# Altium project JacdacBreadboardEc30-16x6 128.PrjPCB
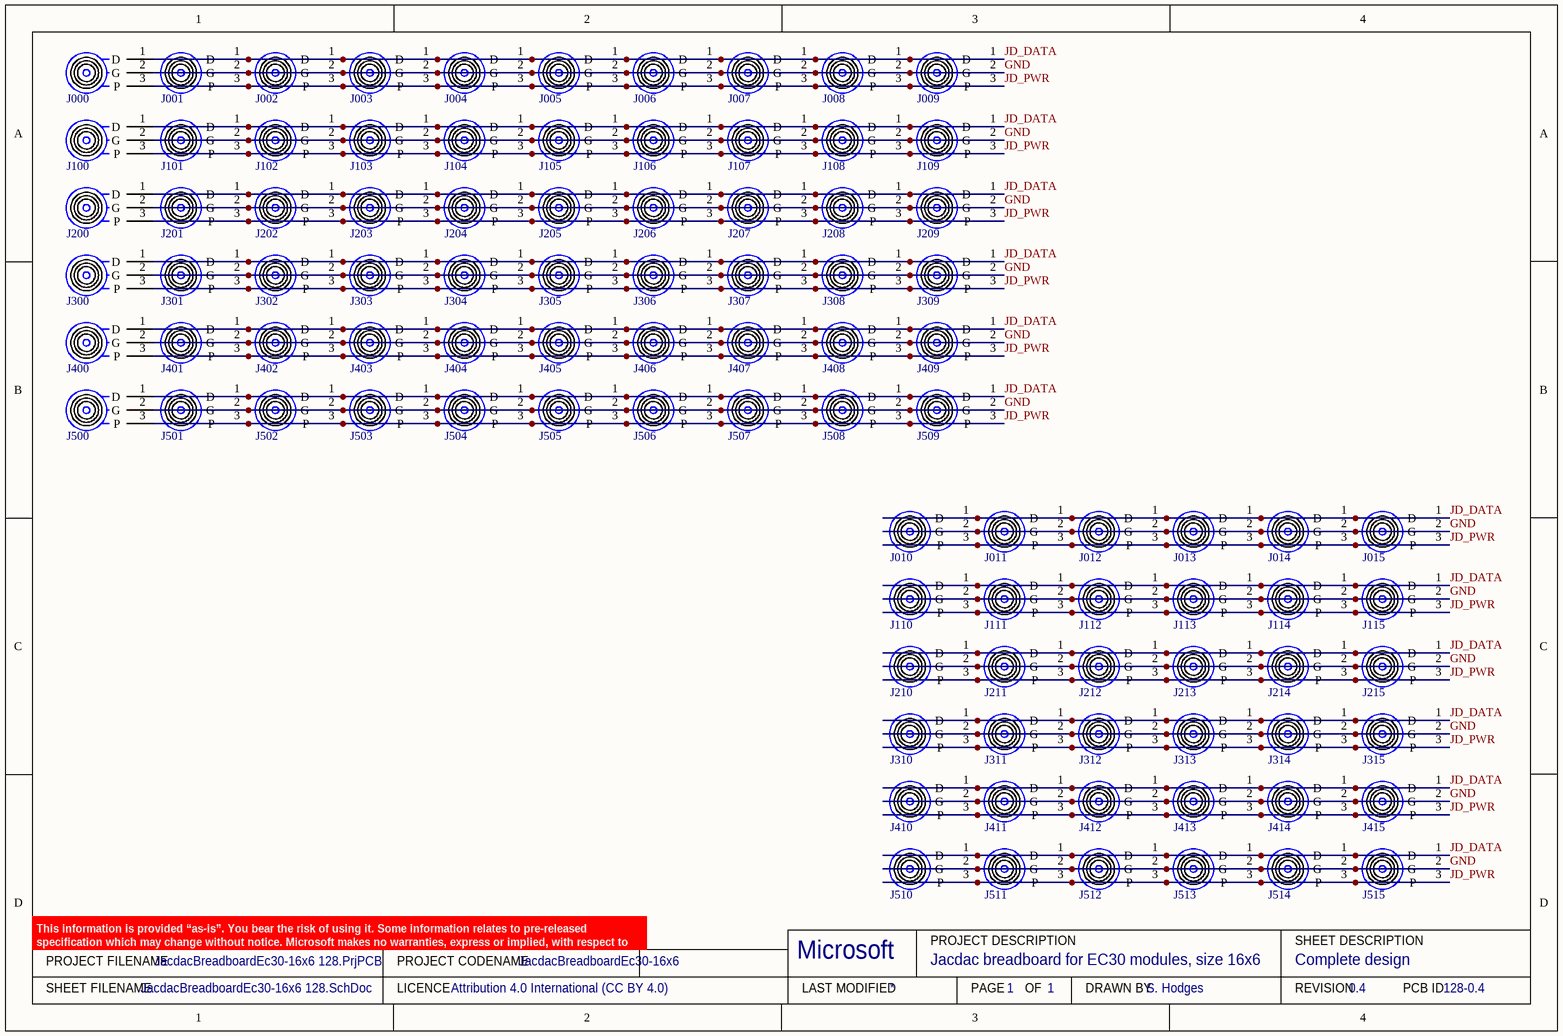
[diagram p0: JacdacBreadboardEc30-16x6 128.SchDoc]
ProjectRevision: 0.4; ProjectLicenceTerms: Attribution 4.0 International (CC BY 4.0); ProjectDrawnBy: S. Hodges; ProjectCodenameID: 128; ProjectCodenameDescription: Jacdac breadboard for EC30 modules, size 16x6; ProjectCodeName: JacdacBreadboardEc30-16x6
1 sheet, 96 parts. Net scope: global (net labels, ports and power ports of the same name join across sheets).
Board file: JacdacBreadboardEc30-16x6 128.PcbDoc

## Sheet JacdacBreadboardEc30-16x6 128.SchDoc: Complete design
size A4; DrawnBy: S. Hodges; DocumentNumber: 1; Revision: 0.4; SheetNumber: 1; SheetTotal: 1; VersionControl_RevNumber: 1

### Parts
J000  Jacdac breadboard MH rings  [Jacdac_breadboard_MH_rings_alternative_v5]  (value not drawn)
J001  Jacdac breadboard MH rings  [Jacdac_breadboard_MH_rings_alternative_v5]  (value not drawn)
J002  Jacdac breadboard MH rings  [Jacdac_breadboard_MH_rings_alternative_v5]  (value not drawn)
J003  Jacdac breadboard MH rings  [Jacdac_breadboard_MH_rings_alternative_v5]  (value not drawn)
J004  Jacdac breadboard MH rings  [Jacdac_breadboard_MH_rings_alternative_v5]  (value not drawn)
J005  Jacdac breadboard MH rings  [Jacdac_breadboard_MH_rings_alternative_v5]  (value not drawn)
J006  Jacdac breadboard MH rings  [Jacdac_breadboard_MH_rings_alternative_v5]  (value not drawn)
J007  Jacdac breadboard MH rings  [Jacdac_breadboard_MH_rings_alternative_v5]  (value not drawn)
J008  Jacdac breadboard MH rings  [Jacdac_breadboard_MH_rings_alternative_v5]  (value not drawn)
J009  Jacdac breadboard MH rings  [Jacdac_breadboard_MH_rings_alternative_v5]  (value not drawn)
J010  Jacdac breadboard MH rings  [Jacdac_breadboard_MH_rings_alternative_v5]  (value not drawn)
J011  Jacdac breadboard MH rings  [Jacdac_breadboard_MH_rings_alternative_v5]  (value not drawn)
J012  Jacdac breadboard MH rings  [Jacdac_breadboard_MH_rings_alternative_v5]  (value not drawn)
J013  Jacdac breadboard MH rings  [Jacdac_breadboard_MH_rings_alternative_v5]  (value not drawn)
J014  Jacdac breadboard MH rings  [Jacdac_breadboard_MH_rings_alternative_v5]  (value not drawn)
J015  Jacdac breadboard MH rings  [Jacdac_breadboard_MH_rings_alternative_v5]  (value not drawn)
J100  Jacdac breadboard MH rings  [Jacdac_breadboard_MH_rings_alternative_v5]  (value not drawn)
J101  Jacdac breadboard MH rings  [Jacdac_breadboard_MH_rings_alternative_v5]  (value not drawn)
J102  Jacdac breadboard MH rings  [Jacdac_breadboard_MH_rings_alternative_v5]  (value not drawn)
J103  Jacdac breadboard MH rings  [Jacdac_breadboard_MH_rings_alternative_v5]  (value not drawn)
J104  Jacdac breadboard MH rings  [Jacdac_breadboard_MH_rings_alternative_v5]  (value not drawn)
J105  Jacdac breadboard MH rings  [Jacdac_breadboard_MH_rings_alternative_v5]  (value not drawn)
J106  Jacdac breadboard MH rings  [Jacdac_breadboard_MH_rings_alternative_v5]  (value not drawn)
J107  Jacdac breadboard MH rings  [Jacdac_breadboard_MH_rings_alternative_v5]  (value not drawn)
J108  Jacdac breadboard MH rings  [Jacdac_breadboard_MH_rings_alternative_v5]  (value not drawn)
J109  Jacdac breadboard MH rings  [Jacdac_breadboard_MH_rings_alternative_v5]  (value not drawn)
J110  Jacdac breadboard MH rings  [Jacdac_breadboard_MH_rings_alternative_v5]  (value not drawn)
J111  Jacdac breadboard MH rings  [Jacdac_breadboard_MH_rings_alternative_v5]  (value not drawn)
J112  Jacdac breadboard MH rings  [Jacdac_breadboard_MH_rings_alternative_v5]  (value not drawn)
J113  Jacdac breadboard MH rings  [Jacdac_breadboard_MH_rings_alternative_v5]  (value not drawn)
J114  Jacdac breadboard MH rings  [Jacdac_breadboard_MH_rings_alternative_v5]  (value not drawn)
J115  Jacdac breadboard MH rings  [Jacdac_breadboard_MH_rings_alternative_v5]  (value not drawn)
J200  Jacdac breadboard MH rings  [Jacdac_breadboard_MH_rings_alternative_v5]  (value not drawn)
J201  Jacdac breadboard MH rings  [Jacdac_breadboard_MH_rings_alternative_v5]  (value not drawn)
J202  Jacdac breadboard MH rings  [Jacdac_breadboard_MH_rings_alternative_v5]  (value not drawn)
J203  Jacdac breadboard MH rings  [Jacdac_breadboard_MH_rings_alternative_v5]  (value not drawn)
J204  Jacdac breadboard MH rings  [Jacdac_breadboard_MH_rings_alternative_v5]  (value not drawn)
J205  Jacdac breadboard MH rings  [Jacdac_breadboard_MH_rings_alternative_v5]  (value not drawn)
J206  Jacdac breadboard MH rings  [Jacdac_breadboard_MH_rings_alternative_v5]  (value not drawn)
J207  Jacdac breadboard MH rings  [Jacdac_breadboard_MH_rings_alternative_v5]  (value not drawn)
J208  Jacdac breadboard MH rings  [Jacdac_breadboard_MH_rings_alternative_v5]  (value not drawn)
J209  Jacdac breadboard MH rings  [Jacdac_breadboard_MH_rings_alternative_v5]  (value not drawn)
J210  Jacdac breadboard MH rings  [Jacdac_breadboard_MH_rings_alternative_v5]  (value not drawn)
J211  Jacdac breadboard MH rings  [Jacdac_breadboard_MH_rings_alternative_v5]  (value not drawn)
J212  Jacdac breadboard MH rings  [Jacdac_breadboard_MH_rings_alternative_v5]  (value not drawn)
J213  Jacdac breadboard MH rings  [Jacdac_breadboard_MH_rings_alternative_v5]  (value not drawn)
J214  Jacdac breadboard MH rings  [Jacdac_breadboard_MH_rings_alternative_v5]  (value not drawn)
J215  Jacdac breadboard MH rings  [Jacdac_breadboard_MH_rings_alternative_v5]  (value not drawn)
J300  Jacdac breadboard MH rings  [Jacdac_breadboard_MH_rings_alternative_v5]  (value not drawn)
J301  Jacdac breadboard MH rings  [Jacdac_breadboard_MH_rings_alternative_v5]  (value not drawn)
J302  Jacdac breadboard MH rings  [Jacdac_breadboard_MH_rings_alternative_v5]  (value not drawn)
J303  Jacdac breadboard MH rings  [Jacdac_breadboard_MH_rings_alternative_v5]  (value not drawn)
J304  Jacdac breadboard MH rings  [Jacdac_breadboard_MH_rings_alternative_v5]  (value not drawn)
J305  Jacdac breadboard MH rings  [Jacdac_breadboard_MH_rings_alternative_v5]  (value not drawn)
J306  Jacdac breadboard MH rings  [Jacdac_breadboard_MH_rings_alternative_v5]  (value not drawn)
J307  Jacdac breadboard MH rings  [Jacdac_breadboard_MH_rings_alternative_v5]  (value not drawn)
J308  Jacdac breadboard MH rings  [Jacdac_breadboard_MH_rings_alternative_v5]  (value not drawn)
J309  Jacdac breadboard MH rings  [Jacdac_breadboard_MH_rings_alternative_v5]  (value not drawn)
J310  Jacdac breadboard MH rings  [Jacdac_breadboard_MH_rings_alternative_v5]  (value not drawn)
J311  Jacdac breadboard MH rings  [Jacdac_breadboard_MH_rings_alternative_v5]  (value not drawn)
J312  Jacdac breadboard MH rings  [Jacdac_breadboard_MH_rings_alternative_v5]  (value not drawn)
J313  Jacdac breadboard MH rings  [Jacdac_breadboard_MH_rings_alternative_v5]  (value not drawn)
J314  Jacdac breadboard MH rings  [Jacdac_breadboard_MH_rings_alternative_v5]  (value not drawn)
J315  Jacdac breadboard MH rings  [Jacdac_breadboard_MH_rings_alternative_v5]  (value not drawn)
J400  Jacdac breadboard MH rings  [Jacdac_breadboard_MH_rings_alternative_v5]  (value not drawn)
J401  Jacdac breadboard MH rings  [Jacdac_breadboard_MH_rings_alternative_v5]  (value not drawn)
J402  Jacdac breadboard MH rings  [Jacdac_breadboard_MH_rings_alternative_v5]  (value not drawn)
J403  Jacdac breadboard MH rings  [Jacdac_breadboard_MH_rings_alternative_v5]  (value not drawn)
J404  Jacdac breadboard MH rings  [Jacdac_breadboard_MH_rings_alternative_v5]  (value not drawn)
J405  Jacdac breadboard MH rings  [Jacdac_breadboard_MH_rings_alternative_v5]  (value not drawn)
J406  Jacdac breadboard MH rings  [Jacdac_breadboard_MH_rings_alternative_v5]  (value not drawn)
J407  Jacdac breadboard MH rings  [Jacdac_breadboard_MH_rings_alternative_v5]  (value not drawn)
J408  Jacdac breadboard MH rings  [Jacdac_breadboard_MH_rings_alternative_v5]  (value not drawn)
J409  Jacdac breadboard MH rings  [Jacdac_breadboard_MH_rings_alternative_v5]  (value not drawn)
J410  Jacdac breadboard MH rings  [Jacdac_breadboard_MH_rings_alternative_v5]  (value not drawn)
J411  Jacdac breadboard MH rings  [Jacdac_breadboard_MH_rings_alternative_v5]  (value not drawn)
J412  Jacdac breadboard MH rings  [Jacdac_breadboard_MH_rings_alternative_v5]  (value not drawn)
J413  Jacdac breadboard MH rings  [Jacdac_breadboard_MH_rings_alternative_v5]  (value not drawn)
J414  Jacdac breadboard MH rings  [Jacdac_breadboard_MH_rings_alternative_v5]  (value not drawn)
J415  Jacdac breadboard MH rings  [Jacdac_breadboard_MH_rings_alternative_v5]  (value not drawn)
J500  Jacdac breadboard MH rings  [Jacdac_breadboard_MH_rings_alternative_v5]  (value not drawn)
J501  Jacdac breadboard MH rings  [Jacdac_breadboard_MH_rings_alternative_v5]  (value not drawn)
J502  Jacdac breadboard MH rings  [Jacdac_breadboard_MH_rings_alternative_v5]  (value not drawn)
J503  Jacdac breadboard MH rings  [Jacdac_breadboard_MH_rings_alternative_v5]  (value not drawn)
J504  Jacdac breadboard MH rings  [Jacdac_breadboard_MH_rings_alternative_v5]  (value not drawn)
J505  Jacdac breadboard MH rings  [Jacdac_breadboard_MH_rings_alternative_v5]  (value not drawn)
J506  Jacdac breadboard MH rings  [Jacdac_breadboard_MH_rings_alternative_v5]  (value not drawn)
J507  Jacdac breadboard MH rings  [Jacdac_breadboard_MH_rings_alternative_v5]  (value not drawn)
J508  Jacdac breadboard MH rings  [Jacdac_breadboard_MH_rings_alternative_v5]  (value not drawn)
J509  Jacdac breadboard MH rings  [Jacdac_breadboard_MH_rings_alternative_v5]  (value not drawn)
J510  Jacdac breadboard MH rings  [Jacdac_breadboard_MH_rings_alternative_v5]  (value not drawn)
J511  Jacdac breadboard MH rings  [Jacdac_breadboard_MH_rings_alternative_v5]  (value not drawn)
J512  Jacdac breadboard MH rings  [Jacdac_breadboard_MH_rings_alternative_v5]  (value not drawn)
J513  Jacdac breadboard MH rings  [Jacdac_breadboard_MH_rings_alternative_v5]  (value not drawn)
J514  Jacdac breadboard MH rings  [Jacdac_breadboard_MH_rings_alternative_v5]  (value not drawn)
J515  Jacdac breadboard MH rings  [Jacdac_breadboard_MH_rings_alternative_v5]  (value not drawn)

### Nets
GND: J000.2(G) J001.2(G) J002.2(G) J003.2(G) J004.2(G) J005.2(G) J006.2(G) J007.2(G) J008.2(G) J009.2(G) J010.2(G) J011.2(G) J012.2(G) J013.2(G) J014.2(G) J015.2(G) J100.2(G) J101.2(G) J102.2(G) J103.2(G) J104.2(G) J105.2(G) J106.2(G) J107.2(G) J108.2(G) J109.2(G) J110.2(G) J111.2(G) J112.2(G) J113.2(G) J114.2(G) J115.2(G) J200.2(G) J201.2(G) J202.2(G) J203.2(G) J204.2(G) J205.2(G) J206.2(G) J207.2(G) J208.2(G) J209.2(G) J210.2(G) J211.2(G) J212.2(G) J213.2(G) J214.2(G) J215.2(G) J300.2(G) J301.2(G) J302.2(G) J303.2(G) J304.2(G) J305.2(G) J306.2(G) J307.2(G) J308.2(G) J309.2(G) J310.2(G) J311.2(G) J312.2(G) J313.2(G) J314.2(G) J315.2(G) J400.2(G) J401.2(G) J402.2(G) J403.2(G) J404.2(G) J405.2(G) J406.2(G) J407.2(G) J408.2(G) J409.2(G) J410.2(G) J411.2(G) J412.2(G) J413.2(G) J414.2(G) J415.2(G) J500.2(G) J501.2(G) J502.2(G) J503.2(G) J504.2(G) J505.2(G) J506.2(G) J507.2(G) J508.2(G) J509.2(G) J510.2(G) J511.2(G) J512.2(G) J513.2(G) J514.2(G) J515.2(G)
JD_DATA: J000.1(D) J001.1(D) J002.1(D) J003.1(D) J004.1(D) J005.1(D) J006.1(D) J007.1(D) J008.1(D) J009.1(D) J010.1(D) J011.1(D) J012.1(D) J013.1(D) J014.1(D) J015.1(D) J100.1(D) J101.1(D) J102.1(D) J103.1(D) J104.1(D) J105.1(D) J106.1(D) J107.1(D) J108.1(D) J109.1(D) J110.1(D) J111.1(D) J112.1(D) J113.1(D) J114.1(D) J115.1(D) J200.1(D) J201.1(D) J202.1(D) J203.1(D) J204.1(D) J205.1(D) J206.1(D) J207.1(D) J208.1(D) J209.1(D) J210.1(D) J211.1(D) J212.1(D) J213.1(D) J214.1(D) J215.1(D) J300.1(D) J301.1(D) J302.1(D) J303.1(D) J304.1(D) J305.1(D) J306.1(D) J307.1(D) J308.1(D) J309.1(D) J310.1(D) J311.1(D) J312.1(D) J313.1(D) J314.1(D) J315.1(D) J400.1(D) J401.1(D) J402.1(D) J403.1(D) J404.1(D) J405.1(D) J406.1(D) J407.1(D) J408.1(D) J409.1(D) J410.1(D) J411.1(D) J412.1(D) J413.1(D) J414.1(D) J415.1(D) J500.1(D) J501.1(D) J502.1(D) J503.1(D) J504.1(D) J505.1(D) J506.1(D) J507.1(D) J508.1(D) J509.1(D) J510.1(D) J511.1(D) J512.1(D) J513.1(D) J514.1(D) J515.1(D)
JD_PWR: J000.3(P) J001.3(P) J002.3(P) J003.3(P) J004.3(P) J005.3(P) J006.3(P) J007.3(P) J008.3(P) J009.3(P) J010.3(P) J011.3(P) J012.3(P) J013.3(P) J014.3(P) J015.3(P) J100.3(P) J101.3(P) J102.3(P) J103.3(P) J104.3(P) J105.3(P) J106.3(P) J107.3(P) J108.3(P) J109.3(P) J110.3(P) J111.3(P) J112.3(P) J113.3(P) J114.3(P) J115.3(P) J200.3(P) J201.3(P) J202.3(P) J203.3(P) J204.3(P) J205.3(P) J206.3(P) J207.3(P) J208.3(P) J209.3(P) J210.3(P) J211.3(P) J212.3(P) J213.3(P) J214.3(P) J215.3(P) J300.3(P) J301.3(P) J302.3(P) J303.3(P) J304.3(P) J305.3(P) J306.3(P) J307.3(P) J308.3(P) J309.3(P) J310.3(P) J311.3(P) J312.3(P) J313.3(P) J314.3(P) J315.3(P) J400.3(P) J401.3(P) J402.3(P) J403.3(P) J404.3(P) J405.3(P) J406.3(P) J407.3(P) J408.3(P) J409.3(P) J410.3(P) J411.3(P) J412.3(P) J413.3(P) J414.3(P) J415.3(P) J500.3(P) J501.3(P) J502.3(P) J503.3(P) J504.3(P) J505.3(P) J506.3(P) J507.3(P) J508.3(P) J509.3(P) J510.3(P) J511.3(P) J512.3(P) J513.3(P) J514.3(P) J515.3(P)

### Notes on the sheet
- This information is provided “as-is”. You bear the risk of using it. Some information relates to pre-released specification which may change without notice. Microsoft makes no warranties, express or implied, with respect to the information provided here.
- PROJECT FILENAME
- PROJECT CODENAME
- Microsoft
- PROJECT DESCRIPTION
- SHEET DESCRIPTION
- SHEET FILENAME
- LICENCE
- LAST MODIFIED
- PAGE
- OF
- DRAWN BY
- REVISION
- PCB ID

### Library data of the parts
J000 J001 J002 J003 J004 J005 J006 J007 J008 J009 J010 J011 J012 J013 J014 J015 J100-J115 J200-J215 J300-J315 J400-J415 J500-J515 = Jacdac breadboard MH rings: Hole Size: M3; Hole Clearance: 7.0mm